# EAGLE design AVR32UC3B_breakout_bak (EAGLE 5.06)
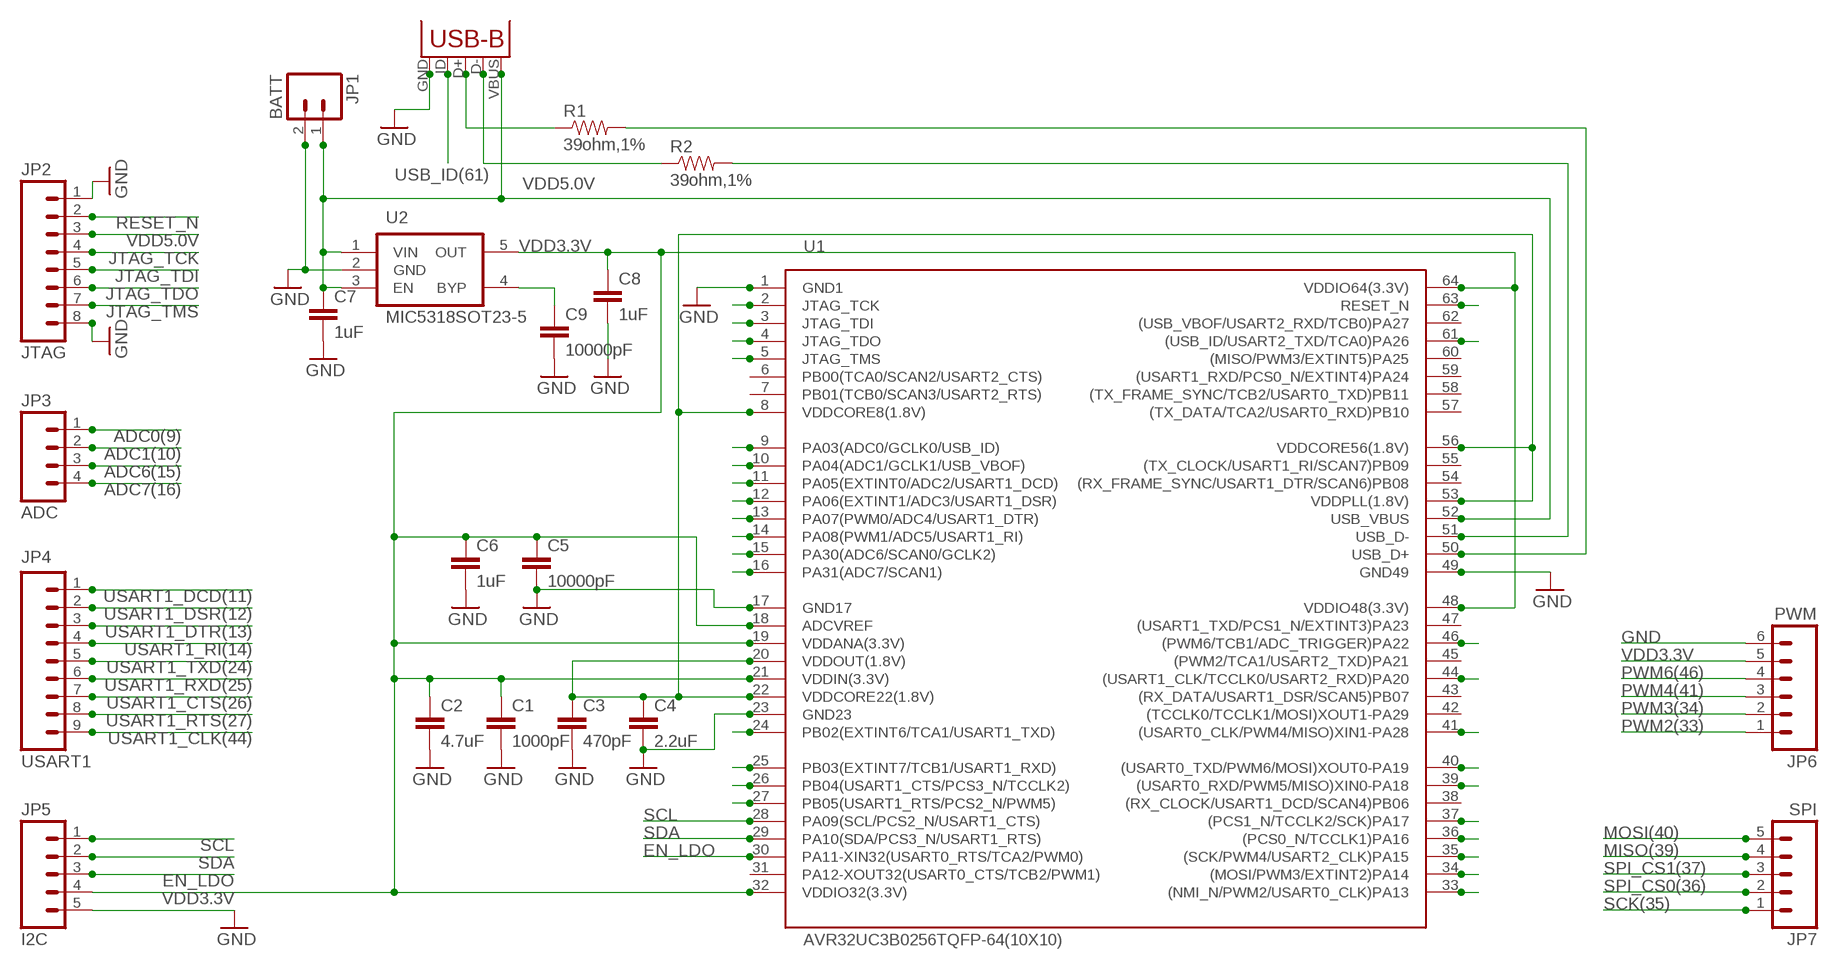
[diagram p0: schematic, sheet 1]

## Parts
C1  1000pF  CAP0603-CAP  [0603-CAP]
C2  4.7uF  CAP1206  [1206]
C3  470pF  CAP0603-CAP  [0603-CAP]
C4  2.2uF  CAP0603-CAP  [0603-CAP]
C5  10000pF  CAP0603-CAP  [0603-CAP]
C6  1uF  CAP0603-CAP  [0603-CAP]
C7  1uF  CAP0603-CAP  [0603-CAP]
C8  1uF  CAP0603-CAP  [0603-CAP]
C9  10000pF  CAP0603-CAP  [0603-CAP]
JP1  BATT  M02-JST-2MM-SMT  [S2B-PH]
JP2  JTAG  M08SMD  [1X08-SMD]
JP3  ADC  M04SMD  [1X04-SMD]
JP4  USART1  M09SMD  [1X09-SMD]
JP5  I2C  M05SMD  [1X05-SMD]
JP6  PWM  M06SMD  [1X06-SMD]
JP7  SPI  M05SMD  [1X05-SMD]
R1  39ohm,1%  RESISTOR  [0805]
R2  39ohm,1%  RESISTOR  [0805]
U1  AVR32UC3B0256TQFP-64(10X10)  [TQFP64-10X10]
U2  MIC5318SOT23-5  [SOT23-5]
X1  USB-MINIBSMD  [USB-MINIB]

## Nets
ADC0(9): JP3.1 U1.9(PA03(ADC0/GCLK0/USB_ID))
ADC1(10): JP3.2 U1.10(PA04(ADC1/GCLK1/USB_VBOF))
ADC6(15): JP3.3 U1.15(PA30(ADC6/SCAN0/GCLK2))
ADC7(16): JP3.4 U1.16(PA31(ADC7/SCAN1))
D+: R1.1 X1.D+
D-: R2.1 X1.D-
EN_LDO: JP5.3 U1.30(PA11-XIN32(USART0_RTS/TCA2/PWM0))
GND: C1.2 C2.2 C3.2 C4.2 C5.2 C6.2 C7.2 C8.2 C9.2 JP1.2 JP2.1 JP2.8 JP5.5 JP6.6 U1.1(GND1) U1.17(GND17) U1.23(GND23) U1.49(GND49) U2.2(GND) X1.GND
JTAG_TCK: JP2.4 U1.2(JTAG_TCK)
JTAG_TDI: JP2.5 U1.3(JTAG_TDI)
JTAG_TDO: JP2.6 U1.4(JTAG_TDO)
JTAG_TMS: JP2.7 U1.5(JTAG_TMS)
MISO(39): JP7.4 U1.39((USART0_RXD/PWM5/MISO)XIN0-PA18)
MOSI(40): JP7.5 U1.40((USART0_TXD/PWM6/MOSI)XOUT0-PA19)
N$1: C9.1 U2.4(BYP)
PWM2(33): JP6.1 U1.33((NMI_N/PWM2/USART0_CLK)PA13)
PWM3(34): JP6.2 U1.34((MOSI/PWM3/EXTINT2)PA14)
PWM4(41): JP6.3 U1.41((USART0_CLK/PWM4/MISO)XIN1-PA28)
PWM6(46): JP6.4 U1.46((PWM6/TCB1/ADC_TRIGGER)PA22)
RESET_N: JP2.2 U1.63(RESET_N)
SCK(35): JP7.1 U1.35((SCK/PWM4/USART2_CLK)PA15)
SCL: JP5.1 U1.28(PA09(SCL/PCS2_N/USART1_CTS))
SDA: JP5.2 U1.29(PA10(SDA/PCS3_N/USART1_RTS))
SPI_CS0(36): JP7.2 U1.36((PCS0_N/TCCLK1)PA16)
SPI_CS1(37): JP7.3 U1.37((PCS1_N/TCCLK2/SCK)PA17)
USART1_CLK(44): JP4.9 U1.44((USART1_CLK/TCCLK0/USART2_RXD)PA20)
USART1_CTS(26): JP4.7 U1.26(PB04(USART1_CTS/PCS3_N/TCCLK2))
USART1_DCD(11): JP4.1 U1.11(PA05(EXTINT0/ADC2/USART1_DCD))
USART1_DSR(12): JP4.2 U1.12(PA06(EXTINT1/ADC3/USART1_DSR))
USART1_DTR(13): JP4.3 U1.13(PA07(PWM0/ADC4/USART1_DTR))
USART1_RI(14): JP4.4 U1.14(PA08(PWM1/ADC5/USART1_RI))
USART1_RTS(27): JP4.8 U1.27(PB05(USART1_RTS/PCS2_N/PWM5))
USART1_RXD(25): JP4.6 U1.25(PB03(EXTINT7/TCB1/USART1_RXD))
USART1_TXD(24): JP4.5 U1.24(PB02(EXTINT6/TCA1/USART1_TXD))
USB_D+: R1.2 U1.50(USB_D+)
USB_D-: R2.2 U1.51(USB_D-)
USB_ID(61): U1.61((USB_ID/USART2_TXD/TCA0)PA26) X1.ID
VDD1.8V: C3.1 C4.1 U1.8(VDDCORE8(1.8V)) U1.20(VDDOUT(1.8V)) U1.22(VDDCORE22(1.8V)) U1.53(VDDPLL(1.8V)) U1.56(VDDCORE56(1.8V))
VDD3.3V: C1.1 C2.1 C5.1 C6.1 C8.1 JP5.4 JP6.5 U1.18(ADCVREF) U1.19(VDDANA(3.3V)) U1.21(VDDIN(3.3V)) U1.32(VDDIO32(3.3V)) U1.48(VDDIO48(3.3V)) U1.64(VDDIO64(3.3V)) U2.5(OUT)
VDD5.0V: C7.1 JP1.1 JP2.3 U1.52(USB_VBUS) U2.1(VIN) U2.3(EN) X1.VBUS
Unconnected: U1.6(PB00(TCA0/SCAN2/USART2_CTS)) U1.7(PB01(TCB0/SCAN3/USART2_RTS)) U1.31(PA12-XOUT32(USART0_CTS/TCB2/PWM1)) U1.38((RX_CLOCK/USART1_DCD/SCAN4)PB06) U1.42((TCCLK0/TCCLK1/MOSI)XOUT1-PA29) U1.43((RX_DATA/USART1_DSR/SCAN5)PB07) U1.45((PWM2/TCA1/USART2_TXD)PA21) U1.47((USART1_TXD/PCS1_N/EXTINT3)PA23) U1.54((RX_FRAME_SYNC/USART1_DTR/SCAN6)PB08) U1.55((TX_CLOCK/USART1_RI/SCAN7)PB09) U1.57((TX_DATA/TCA2/USART0_RXD)PB10) U1.58((TX_FRAME_SYNC/TCB2/USART0_TXD)PB11) U1.59((USART1_RXD/PCS0_N/EXTINT4)PA24) U1.60((MISO/PWM3/EXTINT5)PA25) U1.62((USB_VBOF/USART2_RXD/TCB0)PA27)

## Library data of the parts
C1-C9 = haptic-inu:CAP: Capacitor Standard 0603 ceramic capacitor, and 0.1" leaded capacitor.
JP1 = haptic-inu:M02: Header 2 Standard 2-pin 0.1" header. Use with straight break away headers (SKU : PRT-00116), right angle break away headers (PRT-00553), swiss pins (PRT-00743), machine pins (PRT-00117), and female headers (PRT-00115). Molex polarized connector foot print use with SKU : PRT-08233 with associated crimp pins and housings.
JP2 = haptic-inu:M08: Header 8 Standard 8-pin 0.1" header. Use with straight break away headers (SKU : PRT-00116), right angle break away headers (PRT-00553), swiss pins (PRT-00743), machine pins (PRT-00117), and female headers (PRT-00115).
JP3 = haptic-inu:M04: Header 4 Standard 4-pin 0.1" header. Use with straight break away headers (SKU : PRT-00116), right angle break away headers (PRT-00553), swiss pins (PRT-00743), machine pins (PRT-00117), and female headers (PRT-00115). Molex polarized connector foot print use with SKU : PRT-08231 with associated crimp pins and housings.
JP4 = haptic-inu:M09: Header 9 Standard 9-pin 0.1" header. Use with straight break away headers (SKU : PRT-00116), right angle break away headers (PRT-00553), swiss pins (PRT-00743), machine pins (PRT-00117), and female headers (PRT-00115).
JP5 JP7 = haptic-inu:M05: Header 5 Standard 5-pin 0.1" header. Use with straight break away headers (SKU : PRT-00116), right angle break away headers (PRT-00553), swiss pins (PRT-00743), machine pins (PRT-00117), and female headers (PRT-00115). Molex polarized connector foot print use with SKU : PRT-08230 with associated crimp pins and housings.
JP6 = haptic-inu:M06: Header 6 Standard 6-pin 0.1" header. Use with straight break away headers (SKU : PRT-00116), right angle break away headers (PRT-00553), swiss pins (PRT-00743), machine pins (PRT-00117), and female headers (PRT-00115). Molex polarized connector foot print use with SKU : PRT-08094 with associated crimp pins and housings. NOTES ON THE VARIANTS LOCK and LOCK_LONGPADS... This footprint was designed to help hold the alignment of a through-hole component (i.e. 6-pin header) while soldering it into place. You may notice that each hole has been shifted either up or down by 0.005 of an inch from it's more standard position (which is a perfectly straight line). This slight alteration caused the pins (the squares in the middle) to touch the edges of the holes. Because they are alternating, it causes a "brace" to hold the component in place. 0.005 has proven to be the perfect amount of "off-center" position when using our standard breakaway headers. Although looks a little odd when you look at the bare footprint, once you have a header in there, the alteration is very hard to notice. Also, if you push a header all the way into place, it is covered up entirely on the bottom side. This idea of altering the position of holes to aid alignment will be further integrated into the Sparkfun Library for other footprints. It can help hold any component with 3 or more connection pins.
R1 R2 = haptic-inu:RESISTOR: Resistor Basic schematic elements and footprints for 0603, 1206, and PTH 1/10th watt (small) resistors.
U1 = haptic-inu:AVR32UC3B0256: 32-bit Microcontroller with 256K Bytes In-System Programmable Flash, 32K Bytes Internal High Speed SRAM Source: http://www.atmel.com/dyn/resources/prod_documents/doc32059.pdf
U2 = haptic-inu:MIC5318: Voltage Regulator LDO IC REG ULDO 300MA 3.3V TSOT23-5. 200mV Drop-out voltage at 300mA
X1 = haptic-inu:USB-MINIB: USB Connectors USB-miniB (SMD) is based on the fully proven package SKU : PRT-00587 from SparkFun but enables connection of the USB_ID for host

## Board
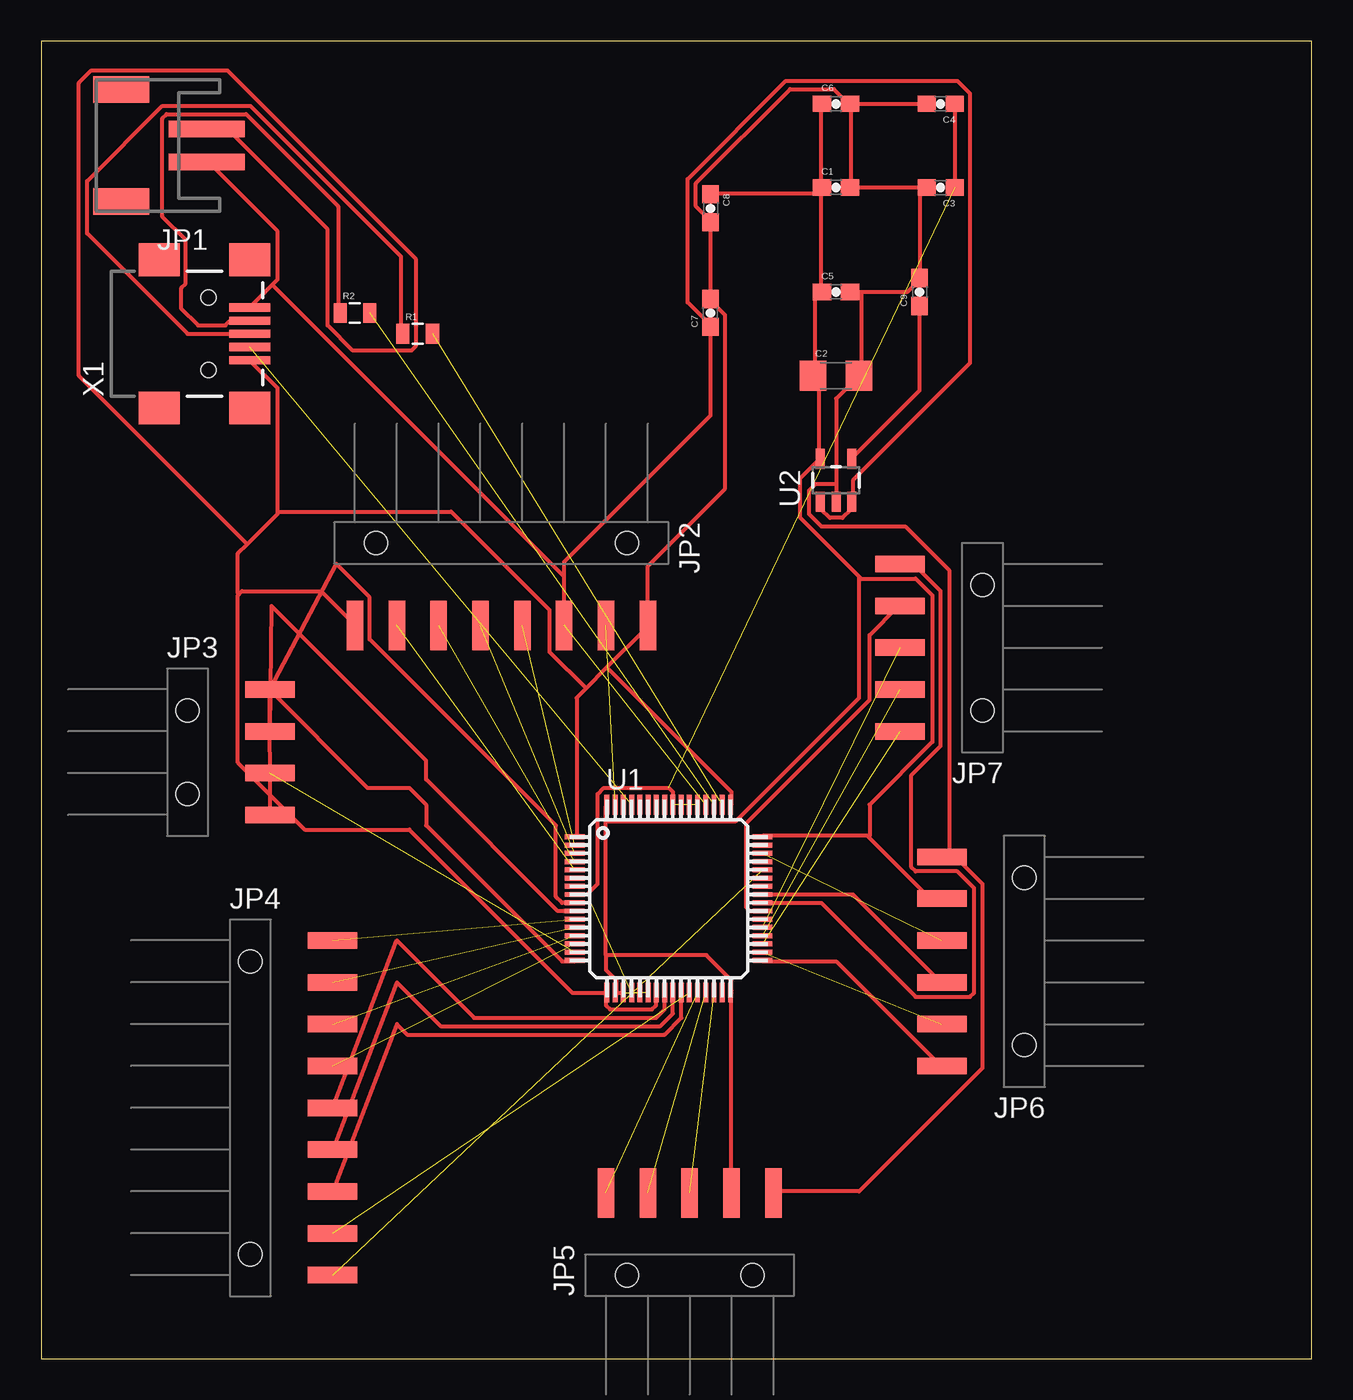
[diagram p1: board, top side]

Size 77.14 x 80 mm. Coordinates in mm from the lower left corner, seen from the top.
Outline: 0,0 77.14,0 77.14,80 0,80 0,0
Copper layers (1*16): Top 0.035mm / dielectric 1.5mm / Bottom 0.035mm
Design rules "default": minimum track width 10mil, minimum drill 24mil, track to track 8mil, track to pad 8mil, pad to pad 8mil, via to via 8mil, smd to smd 8mil, copper to edge 40mil, drill to drill 8mil, minimum pad ring 10mil, minimum via ring 8mil, stop-mask expansion 4mil, vias tented up to drill 0mil, thermal gap 10mil

### Footprints (pad centres in the part's own frame; a part is rotated, then mirrored left to right if it is on the bottom)
0603-CAP = smd 1.1 x 1: 1 -0.85,0; 2 0.85,0
1206 = smd 1.6 x 1.8: 1 -1.4,0; 2 1.4,0
S2B-PH = smd 1 x 4.6: 1 -1,-3.7; 2 1,-3.7 | smd 1.6 x 3.4: NC1 -3.4,1.5; NC2 3.4,1.5
1X08-SMD = smd 1 x 3: 1 -6.35,5; 2 -3.81,5; 3 -1.27,5; 4 1.27,5; 5 3.81,5; 6 6.35,5; 7 8.89,5; 8 11.43,5 | hole 1.4: -5.08,0; 10.16,0
1X04-SMD = smd 1 x 3: 1 -3.81,5; 2 -1.27,5; 3 1.27,5; 4 3.81,5 | hole 1.4: -2.54,0; 2.54,0
1X09-SMD = smd 1 x 3: 1 -10.16,5; 2 -7.62,5; 3 -5.08,5; 4 -2.54,5; 5 0,5; 6 2.54,5; 7 5.08,5; 8 7.62,5; 9 10.16,5 | hole 1.4: 8.89,0; -8.89,0
1X05-SMD = smd 1 x 3: 1 -5.08,5; 2 -2.54,5; 3 0,5; 4 2.54,5; 5 5.08,5 | hole 1.4: -3.81,0; 3.81,0
1X06-SMD = smd 1 x 3: 1 -6.35,5; 2 -3.81,5; 3 -1.27,5; 4 1.27,5; 5 3.81,5; 6 6.35,5 | hole 1.4: -5.08,0; 5.08,0
0805 = smd 0.8 x 1.2: 1 -0.9,0; 2 0.9,0
TQFP64-10X10 = smd 1.2 x 0.3: 1 -5.7,3.75; 2 -5.7,3.25; 3 -5.7,2.75; 4 -5.7,2.25; 5 -5.7,1.75; 6 -5.7,1.25; 7 -5.7,0.75; 8 -5.7,0.25; 9 -5.7,-0.25; 10 -5.7,-0.75; 11 -5.7,-1.25; 12 -5.7,-1.75; 13 -5.7,-2.25; 14 -5.7,-2.75; 15 -5.7,-3.25; 16 -5.7,-3.75; 33 5.7,-3.75; 34 5.7,-3.25; 35 5.7,-2.75; 36 5.7,-2.25; 37 5.7,-1.75; 38 5.7,-1.25; 39 5.7,-0.75; 40 5.7,-0.25; 41 5.7,0.25; 42 5.7,0.75; 43 5.7,1.25; 44 5.7,1.75; 45 5.7,2.25; 46 5.7,2.75; 47 5.7,3.25; 48 5.7,3.75 | smd 0.3 x 1.2: 17 -3.75,-5.7; 18 -3.25,-5.7; 19 -2.75,-5.7; 20 -2.25,-5.7; 21 -1.75,-5.7; 22 -1.25,-5.7; 23 -0.75,-5.7; 24 -0.25,-5.7; 25 0.25,-5.7; 26 0.75,-5.7; 27 1.25,-5.7; 28 1.75,-5.7; 29 2.25,-5.7; 30 2.75,-5.7; 31 3.25,-5.7; 32 3.75,-5.7; 49 3.75,5.7; 50 3.25,5.7; 51 2.75,5.7; 52 2.25,5.7; 53 1.75,5.7; 54 1.25,5.7; 55 0.75,5.7; 56 0.25,5.7; 57 -0.25,5.7; 58 -0.75,5.7; 59 -1.25,5.7; 60 -1.75,5.7; 61 -2.25,5.7; 62 -2.75,5.7; 63 -3.25,5.7; 64 -3.75,5.7
SOT23-5 = smd 0.55 x 1.2: 1 -0.95,-1.3; 2 0,-1.3; 3 0.95,-1.3; 4 0.95,1.3; 5 -0.95,1.3
USB-MINIB = smd 2.5 x 0.5: D+ 2.5,0; D- 2.5,0.8; GND 2.5,-1.6; ID 2.5,-0.8; VBUS 2.5,1.6 | smd 2.5 x 2: GND@1 -3,-4.5; GND@2 -3,4.5; GND@3 2.5,4.5; GND@4 2.5,-4.5 | hole 0.9: 0,2.2; 0,-2.2

### Placement (x,y rotation side)
C1  48.26,71.12 0 top
C2  48.26,59.69 0 top
C3  54.61,71.12 180 top
C4  54.61,76.2 180 top
C5  48.26,64.77 0 top
C6  48.26,76.2 0 top
C7  40.64,63.5 90 top
C8  40.64,69.85 270 top
C9  53.34,64.77 90 top
JP1  6.35,73.66 90 top
JP2  30.48,49.53 180 top
JP3  8.89,36.83 270 top
JP4  12.7,15.24 270 top
JP5  39.37,5.08 0 top
JP6  59.69,24.13 90 top
JP7  57.15,43.18 90 top
R1  22.86,62.23 0 top
R2  19.05,63.5 0 top
U1  38.1,27.94 0 top
U2  48.26,53.34 0 top
X1  10.16,62.23 0 top

### Tracks (layer width: path | path; a pad name or v marks a point on that pad's centre or on a via)
ADC0(9)
  Top 0.254: U1.9 32.38,27.69 31.62,27.69 31.24,28.07 31.24,32.38 19.94,43.69 19.94,46.23 17.91,48.26 JP3.1
ADC1(10)
  Top 0.254: U1.10 32.38,27.18 31.37,27.18 23.37,35.18 23.37,36.32 13.97,45.72 JP3.2
ADC6(15)  (1 unrouted)
ADC7(16)
  Top 0.254: U1.16 32.38,24.13 31.62,24.13 23.37,32.38 23.37,33.66 22.35,34.67 19.81,34.67 13.84,40.64 JP3.4
D+
  Top 0.254: R1.1 21.84,62.23 21.84,66.93 12.7,76.07 7.37,76.07 2.79,71.5 2.79,68.33 8.89,62.23 X1.D+
D-
  Top 0.254: R2.1 18.03,63.5 18.03,69.98 12.45,75.56 7.62,75.56 7.37,75.31 7.37,69.34 8.76,67.94 8.76,65.28 8.51,65.02 8.51,63.75 9.53,62.74 11.18,62.74 11.43,62.99 12.57,62.99 X1.D-
EN_LDO  (1 unrouted)
GND
  Top 0.254: 34.29,22.23 34.29,21.46 34.54,21.21 37.08,21.21 37.34,21.46 37.34,22.23 U1.23 | 34.29,22.23 U1.17 | 12,46.42 12.19,46.61 17.02,46.61 19.05,44.58 JP2.8 | 12,46.42 11.94,46.35 11.94,36.2 16,32.13 22.35,32.13 32.26,22.23 34.29,22.23 | 14.35,51.44 14.35,51.31 12.51,49.47 | 14.35,51.44 14.35,58.93 12.7,60.58 X1.GND | 12.51,49.47 11.94,48.9 11.94,46.48 12,46.42 | JP1.2 10.16,74.55 11.43,74.55 17.4,68.58 17.4,62.74 18.92,61.21 22.48,61.21 22.73,61.47 22.73,66.8 11.3,78.23 3.05,78.23 2.29,77.47 2.29,59.69 12.51,49.47 | 55.12,30.48 55.5,30.48 57.15,28.83 57.15,17.65 49.66,10.16 44.45,10.16 JP5.5 | 55.12,30.48 JP6.6 55.12,30.48 | 34.35,41.97 36.83,44.45 JP2.1 36.83,48.13 41.53,52.83 41.53,63.37 40.64,64.26 C7.2 C8.2 40.64,69.09 39.75,69.98 39.75,71.37 45.47,77.09 48.13,77.09 49.02,76.2 C6.2 49.15,76.2 | 33.08,40.7 34.35,41.97 | 33.08,40.7 32.51,40.13 32.51,31.75 U1.1 | U1.49 41.91,33.66 41.91,34.42 34.35,41.97 | 49.78,64.77 52.58,64.77 53.34,65.53 C9.2 53.34,71.12 | 49.78,64.77 C5.2 | 48.26,53.09 48.26,58.29 C2.2 49.78,59.69 49.78,64.77 | 48.26,53.09 U2.2 | 49.15,71.12 53.34,71.12 | 53.34,71.12 C3.2 53.34,71.12 | 49.15,76.2 C4.2 | 49.15,76.2 49.15,71.12 | 49.15,71.12 C1.2 | 55.12,30.48 55.12,47.88 52.45,50.55 47.37,50.55 46.61,51.31 46.61,52.7 46.99,53.09 48.26,53.09 | 14.35,51.44 24.89,51.44 30.86,45.47 30.86,42.93 33.08,40.7
JTAG_TCK  (1 unrouted)
JTAG_TDI  (1 unrouted)
JTAG_TDO  (1 unrouted)
JTAG_TMS  (1 unrouted)
MISO(39)
  Top 0.254: U1.39 43.69,27.18 43.05,27.18 42.8,27.43 42.8,32.51 50.29,40.01 50.29,43.94 52.07,45.72 JP7.4
MOSI(40)
  Top 0.254: U1.40 43.81,27.69 47.37,27.69 53.09,21.97 56.39,21.97 56.64,22.23 56.64,28.57 55.63,29.59 53.09,29.59 52.83,29.84 52.83,35.43 54.61,37.21 54.61,46.61 52.96,48.26 JP7.5
N$1
  Top 0.254: C9.1 53.34,58.8 49.28,54.74 U2.4
PWM2(33)
  Top 0.254: U1.33 43.81,24.13 48.26,24.13 54.61,17.78 JP6.1
PWM3(34)  (1 unrouted)
PWM4(41)
  Top 0.254: U1.41 43.81,28.19 49.28,28.19 54.61,22.86 JP6.3
PWM6(46)  (1 unrouted)
RESET_N  (1 unrouted)
SCK(35)  (1 unrouted)
SCL  (1 unrouted)
SDA  (1 unrouted)
SPI_CS0(36)  (1 unrouted)
SPI_CS1(37)  (1 unrouted)
USART1_CLK(44)  (1 unrouted)
USART1_CTS(26)
  Top 0.254: U1.26 38.86,22.23 38.86,20.7 37.85,19.68 22.23,19.68 21.59,20.32 JP4.7
USART1_DCD(11)  (1 unrouted)
USART1_DSR(12)  (1 unrouted)
USART1_DTR(13)  (1 unrouted)
USART1_RI(14)  (1 unrouted)
USART1_RTS(27)  (1 unrouted)
USART1_RXD(25)
  Top 0.254: U1.25 38.35,22.23 38.35,20.95 37.59,20.19 24.26,20.19 21.59,22.86 JP4.6
USART1_TXD(24)
  Top 0.254: U1.24 37.85,22.23 37.85,21.21 37.34,20.7 26.29,20.7 21.59,25.4 JP4.5
USB_D+  (1 unrouted)
USB_D-  (1 unrouted)
USB_ID(61)  (1 unrouted)
VDD1.8V  (4 unrouted)
  Top 0.254: U1.8 32.51,28.19 33.15,28.19 33.78,28.83 33.78,34.29 34.16,34.67 38.1,34.67 38.35,34.42 38.35,33.66 U1.56 | C3.1 55.5,71.12 55.5,76.2 C4.1
VDD3.3V  (1 unrouted)
  Top 0.254: U1.19 35.31,22.23 34.92,22.23 U1.18 34.92,22.35 34.92,22.99 34.29,23.62 34.29,24.51 | 34.29,24.51 34.29,32.64 | 34.29,32.64 34.29,33.53 U1.64 | JP5.4 41.91,22.23 U1.32 41.91,22.35 41.91,22.99 40.39,24.51 34.29,24.51 | 50.23,31.69 53.98,27.94 JP6.5 | 50.23,31.69 50.16,31.75 43.81,31.75 U1.48 | 47.37,71.12 46.99,70.74 40.64,70.74 C8.1 | 47.37,64.77 47.37,70.99 C1.1 47.37,71.12 | 47.37,71.12 47.37,76.2 C6.1 | 47.37,64.77 46.99,64.39 46.99,59.69 C2.1 47.24,59.31 47.24,54.74 U2.5 47.24,54.61 46.1,53.47 46.1,51.05 49.72,47.43 | 47.37,64.77 C5.1 | 49.72,47.43 49.78,47.37 53.09,47.37 54.1,46.35 54.1,37.47 50.29,33.66 50.29,31.75 50.23,31.69 | 34.29,32.64 42.16,32.64 49.66,40.13 49.66,47.37 49.72,47.43
VDD5.0V  (1 unrouted)
  Top 0.254: 14.03,65.22 14.35,65.53 14.35,68.45 10.16,72.64 JP1.1 | 14.03,65.22 12.7,63.88 X1.VBUS | U2.1 47.37,51.94 47.37,51.56 47.88,51.05 48.64,51.05 49.15,51.56 49.15,51.94 U2.3 49.28,52.07 49.28,53.34 56.39,60.45 56.39,76.83 55.63,77.6 45.21,77.6 39.24,71.63 39.24,64.14 40.64,62.74 C7.1 40.64,57.28 31.75,48.39 31.75,47.5 | JP2.3 31.75,47.5 | 31.75,47.5 14.03,65.22